# EAGLE design bristol_longshot (EAGLE 7.3.0)
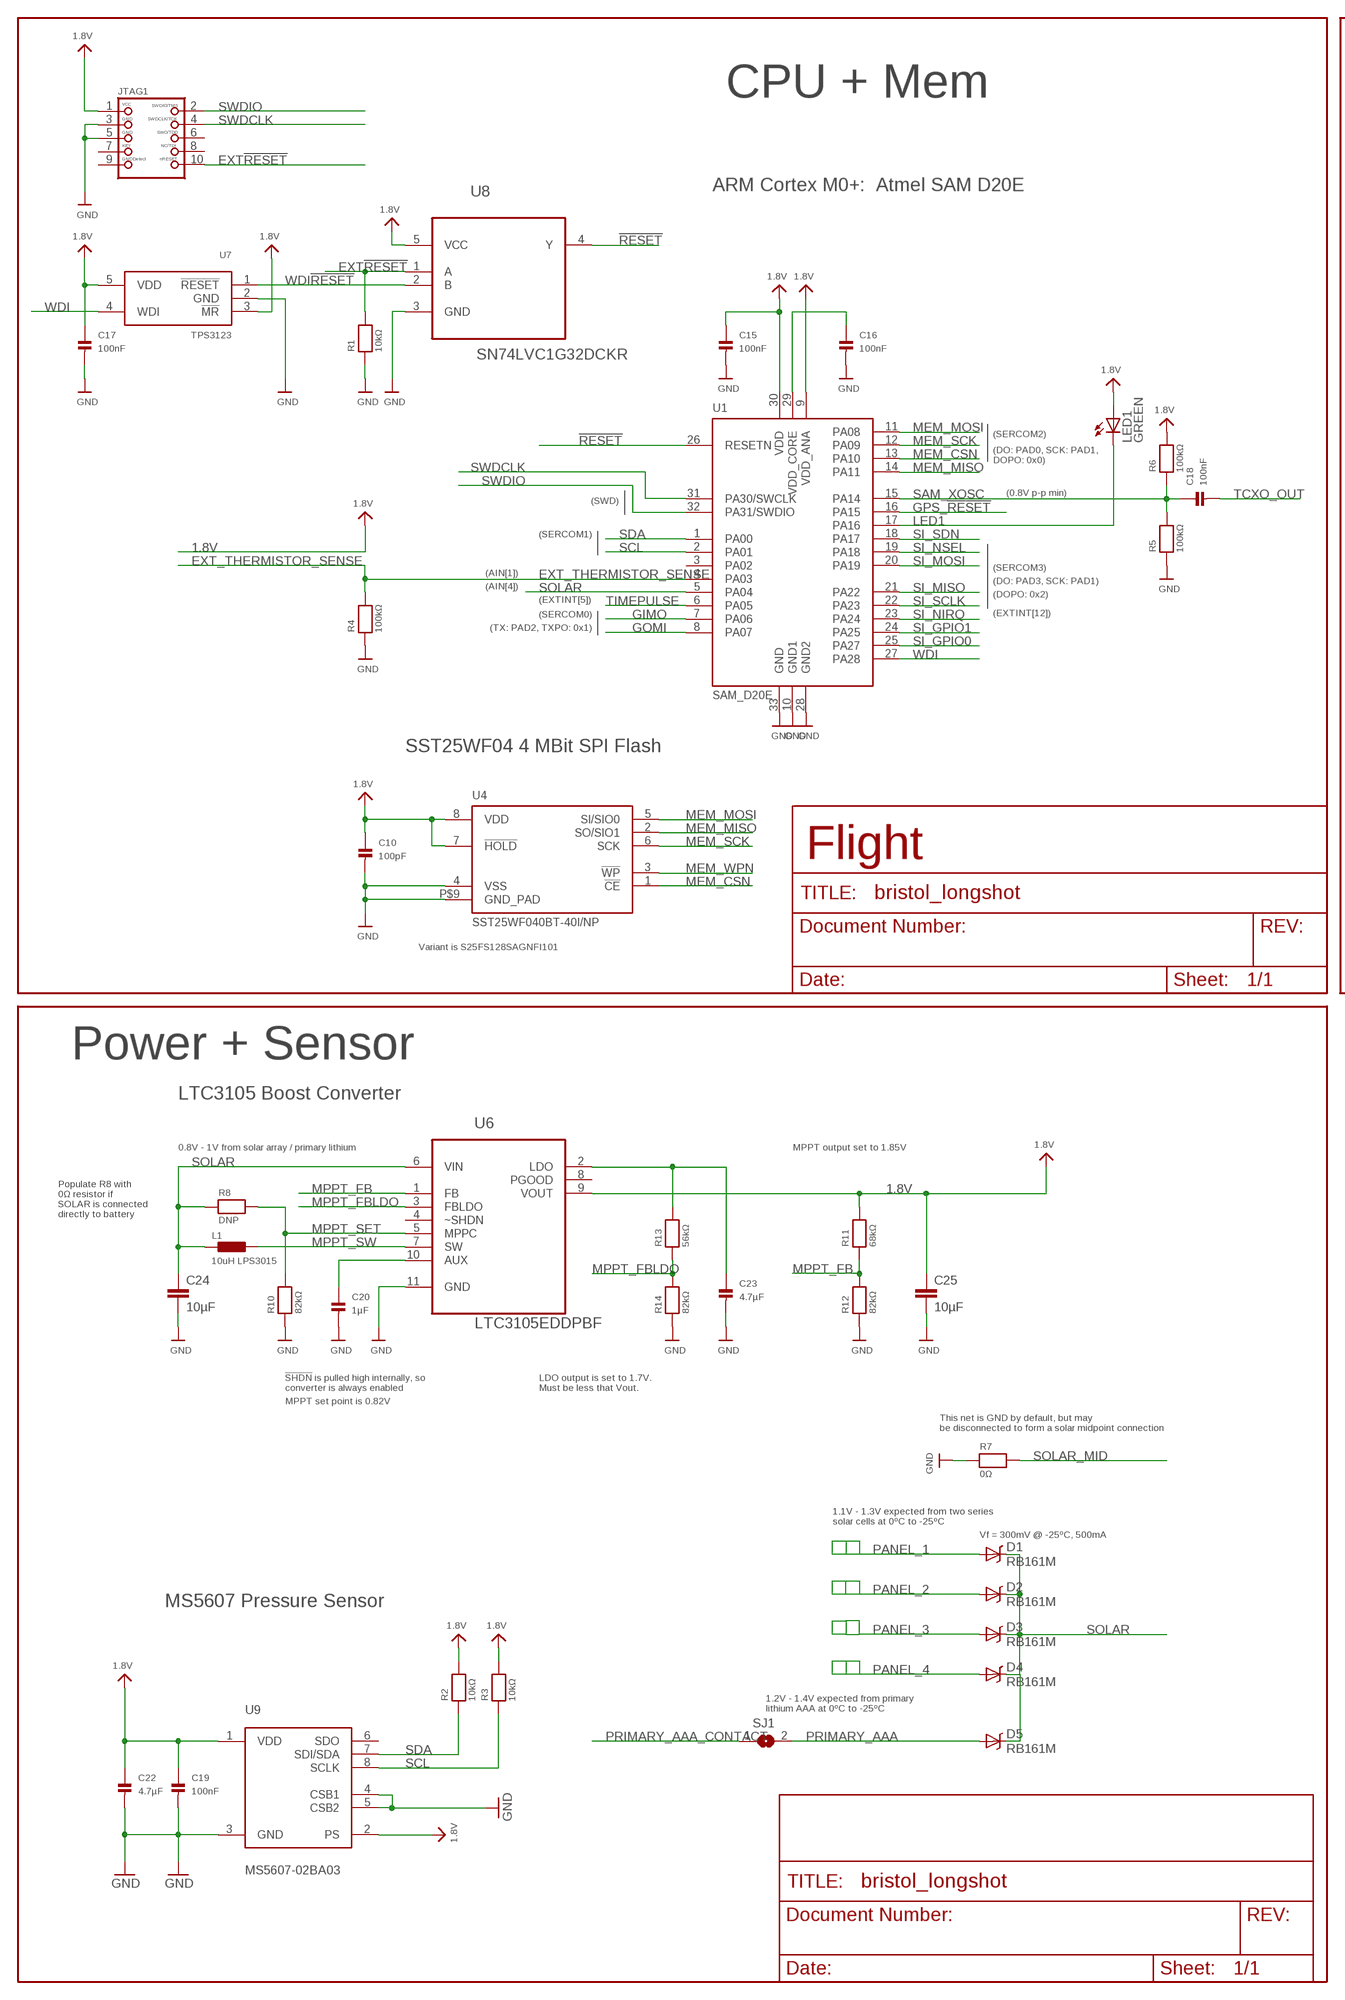
[diagram p0: schematic, sheet 1, part 1 of 2]
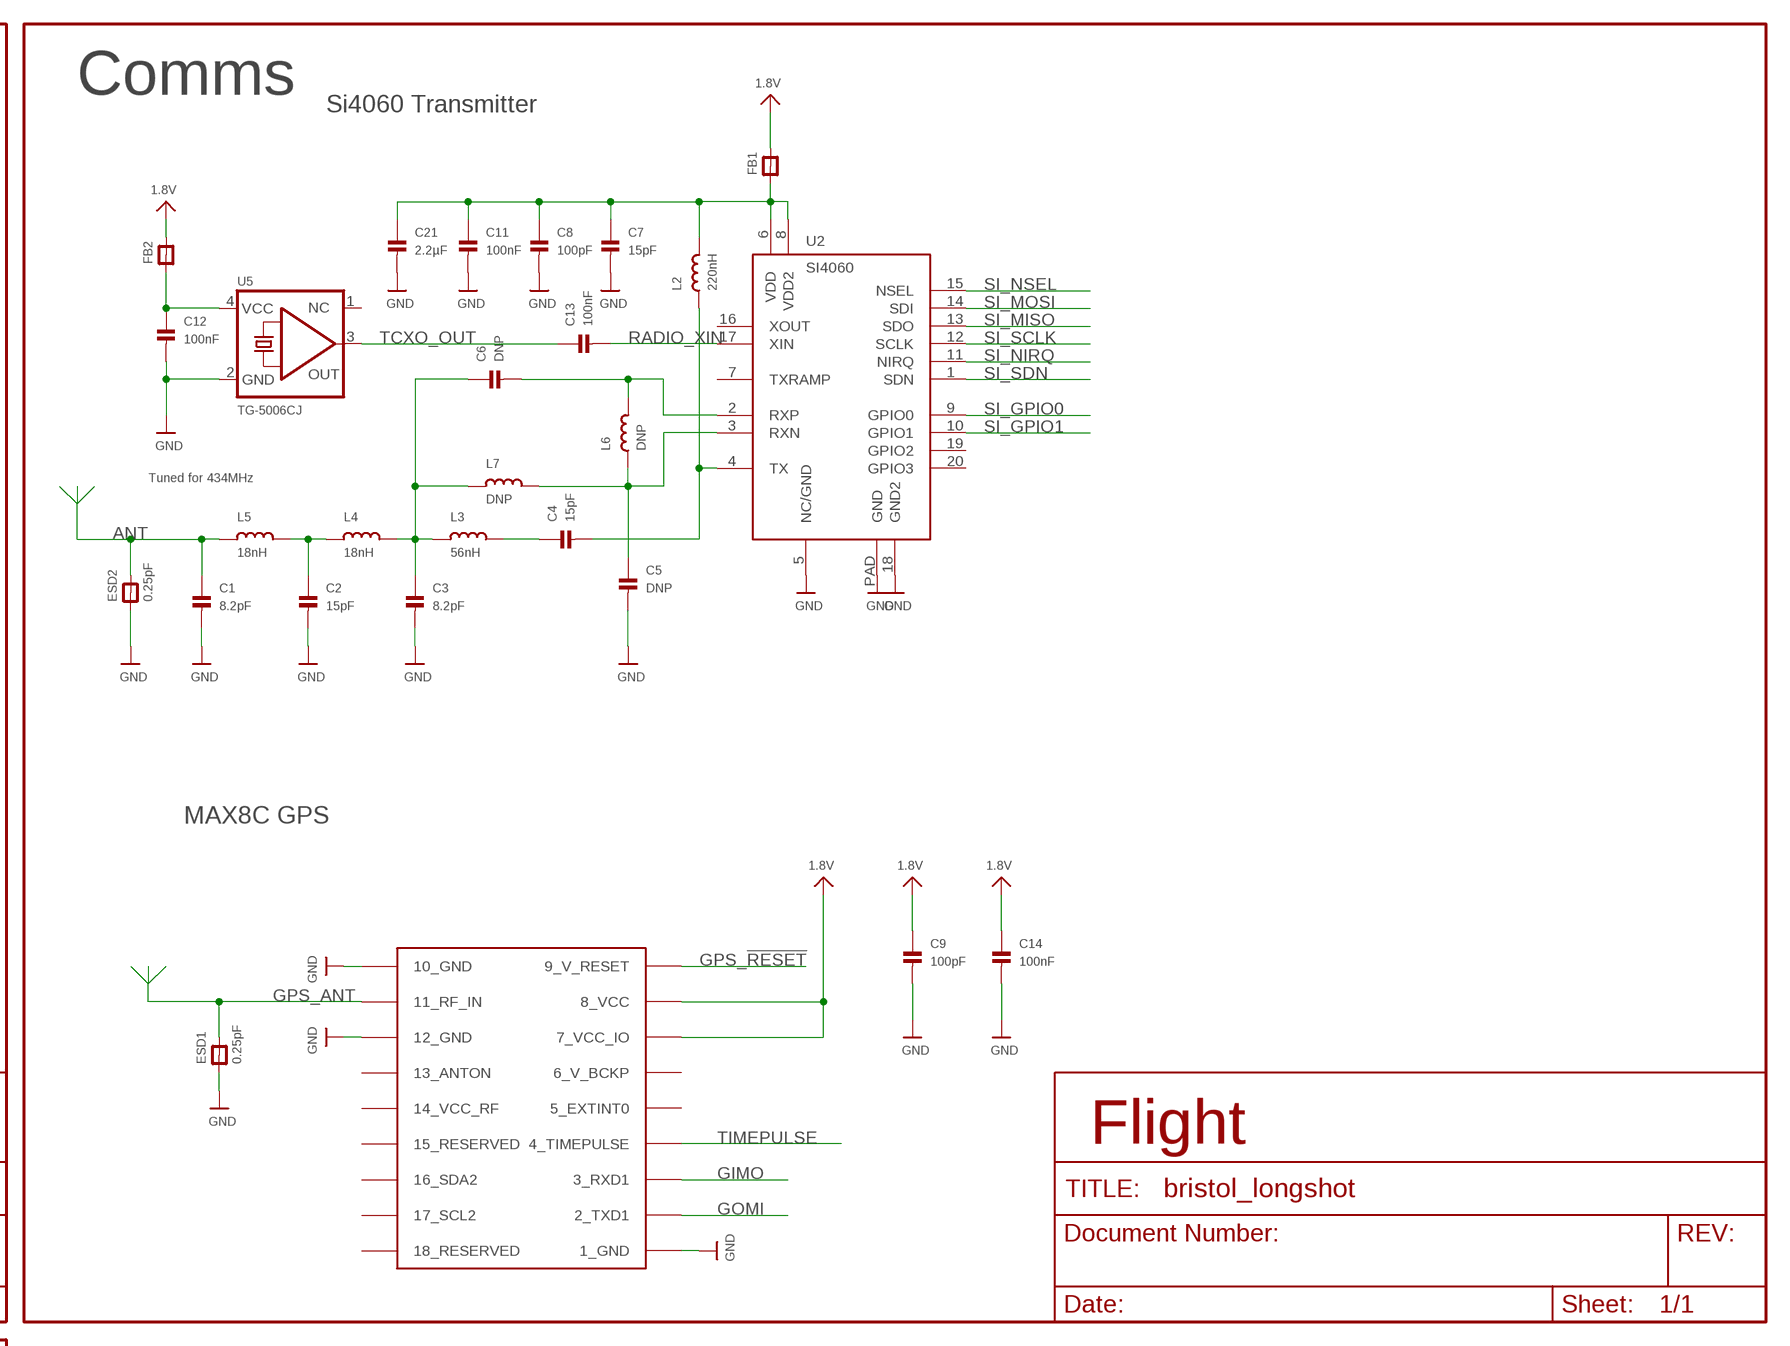
[diagram p1: schematic, sheet 1, part 2 of 2]

## Parts
C1  8.2pF  CAP_CERAMIC_0402  [_0402@1]
C2  15pF  CAP_CERAMIC_0402  [_0402@1]
C3  8.2pF  CAP_CERAMIC_0402  [_0402@1]
C4  15pF  CAP_CERAMIC_0402  [_0402@1]
C5  DNP  CAP_CERAMIC_0402  [_0402@1]
C6  DNP  CAP_CERAMIC_0402  [_0402@1]
C7  15pF  CAP_CERAMIC_0402  [_0402@1]
C8  100pF  CAP_CERAMIC_0402  [_0402@1]
C9  100pF  CAP_CERAMIC_0402  [_0402@1]
C10  100pF  CAP_CERAMIC_0402  [_0402@1]
C11  100nF  CAP_CERAMIC_0402  [_0402@1]
C12  100nF  CAP_CERAMIC_0402  [_0402@1]
C13  100nF  CAP_CERAMIC_0402  [_0402@1]
C14  100nF  CAP_CERAMIC_0402  [_0402@1]
C15  100nF  CAP_CERAMIC_0402  [_0402@1]
C16  100nF  CAP_CERAMIC_0402  [_0402@1]
C17  100nF  CAP_CERAMIC_0402  [_0402@1]
C18  100nF  CAP_CERAMIC_0402  [_0402@1]
C19  100nF  CAP_CERAMIC_0402  [_0402@1]
C20  1µF  CAP_CERAMIC_0402  [_0402@1]
C21  2.2µF  CAP_CERAMIC_0402  [_0402@1]
C22  4.7µF  CAP_CERAMIC_0402  [_0402@1]
C23  4.7µF  CAP_CERAMIC_0402  [_0402@1]
C24  10µF  C-EUC0603K  [C0603K]
C25  10µF  C-EUC0603K  [C0603K]
D1  RB161M  [RB161M]
D2  RB161M  [RB161M]
D3  RB161M  [RB161M]
D4  RB161M  [RB161M]
D5  RB161M  [RB161M]
ESD1  0.25pF  FERRITE_0603MP  [_0603MP]
ESD2  0.25pF  FERRITE_0603MP  [_0603MP]
FB1  FERRITE_0402  [_0402@1]
FB2  FERRITE_0402  [_0402@1]
JTAG1  JTAG-CORTEXM3SMT  [2X05_1.27MM_SMT]
L1  10uH LPS3015  IND-LPS3015  [LPS3015]
L2  220nH  INDUCTOR_0402  [_0402@1]
L3  56nH  INDUCTOR_0402  [_0402@1]
L4  18nH  INDUCTOR_0402  [_0402@1]
L5  18nH  INDUCTOR_0402  [_0402@1]
L6  DNP  INDUCTOR_0402  [_0402@1]
L7  DNP  INDUCTOR_0402  [_0402@1]
LED1  GREEN  LEDCHIPLED_0603  [CHIPLED_0603]
R1  10kΩ  RESISTOR_0402  [_0402]
R2  10kΩ  RESISTOR_0402  [_0402]
R3  10kΩ  RESISTOR_0402  [_0402]
R4  100kΩ  RESISTOR_0402  [_0402]
R5  100kΩ  RESISTOR_0402  [_0402]
R6  100kΩ  RESISTOR_0402  [_0402]
R7  0Ω  RESISTOR_0402  [_0402]
R8  DNP  RESISTOR_0402  [_0402]
R10  82kΩ  RESISTOR_0402  [_0402]
R11  68kΩ  RESISTOR_0402  [_0402]
R12  82kΩ  RESISTOR_0402  [_0402]
R13  56kΩ  RESISTOR_0402  [_0402]
R14  82kΩ  RESISTOR_0402  [_0402]
SJ1  SOLDERJUMPERREFLOW  [SOLDERJUMPER_REFLOW]
U1  SAM_D20E  [QFN32_5MM]
U2  SI4060  [QFN20]
U3  UBLOX_MAX  [UBLOX_MAX]
U4  SST25WF040BT-40I/NP  [USON-8]
U5  TG-5006CJ  [TC-5006CJ]
U6  LTC3105EDDPBF  [DFN300X300X80-11N]
U7  TPS3123  [SOT23-5]
U8  SN74LVC1G32DCKR  [SOT65P210X110-5N]
U9  MS5607-02BA03  [MS5607-02BA03]

## Nets
1.8V: C9.1 C10.1 C14.1 C15.1 C17.1 C19.1 C22.1 C25.1 FB1.2 FB2.2 JTAG1.1 LED1.A R2.2 R3.2 R6.2 R11.2 U1.9(VDD_ANA) U1.30(VDD) U3.7_VCC_IO U3.8_VCC U4.7(!HOLD) U4.8(VDD) U6.9(VOUT) U7.3(!MR) U7.5(VDD) U8.5(VCC) U9.1(VDD) U9.2(PS)
!RESET: U1.26(RESETN) U8.4(Y)
ANT: C1.1 ESD2.2 L5.1
EXT!RESET: JTAG1.10 R1.2 U8.1(A)
EXT_THERMISTOR_SENSE: R4.2 U1.4(PA03)
FILTER1: C3.1 C6.1 L3.1 L4.2 L7.1
FILTER2: C2.1 L4.1 L5.2
GIMO: U1.7(PA06) U3.3_RXD1
GND: C1.2 C2.2 C3.2 C5.2 C7.2 C8.2 C9.2 C10.2 C11.2 C12.2 C14.2 C15.2 C16.2 C17.2 C19.2 C20.2 C21.2 C22.2 C23.2 C24.2 C25.2 ESD1.1 ESD2.1 JTAG1.3 JTAG1.5 R1.1 R4.1 R5.1 R7.1 R10.1 R12.1 R14.1 U1.10(GND1) U1.28(GND2) U1.33(GND) U2.5(NC/GND) U2.18(GND2) U2.PAD(GND) U3.1_GND U3.10_GND U3.12_GND U4.4(VSS) U4.P$9(GND_PAD) U5.2(GND) U6.11(GND) U7.2(GND) U8.3(GND) U9.3(GND) U9.4(CSB1) U9.5(CSB2)
GOMI: U1.8(PA07) U3.2_TXD1
GPS_!RESET: U1.16(PA15) U3.9_V_RESET
GPS_ANT: ESD1.2 U3.11_RF_IN
LED1: LED1.C U1.17(PA16)
MEM_CSN: U1.13(PA10) U4.1(!CE)
MEM_MISO: U1.14(PA11) U4.2(SO/SIO1)
MEM_MOSI: U1.11(PA08) U4.5(SI/SIO0)
MEM_SCK: U1.12(PA09) U4.6(SCK)
MEM_WPN: U4.3(!WP)
MPPT_AUX: C20.1 U6.10(AUX)
MPPT_FB: R11.1 R12.2 U6.1(FB)
MPPT_FBLDO: R13.1 R14.2 U6.3(FBLDO)
MPPT_LDO: C23.1 R13.2 U6.2(LDO)
MPPT_SET: R8.2 R10.2 U6.5(MPPC)
MPPT_SW: L1.2_1 L1.2_2 L1.2_3 L1.2_4 L1.2_5 L1.2_6 L1.2_7 L1.2_8 L1.2_9 U6.7(SW)
PANEL_1: D1.ANODE(A)
PANEL_2: D2.ANODE(A)
PANEL_3: D3.ANODE(A)
PANEL_4: D4.ANODE(A)
PRIMARY_AAA: D5.ANODE(A) SJ1.2
PRIMARY_AAA_CONTACT: SJ1.1
RADIO_VDD: C7.1 C8.1 C11.1 C21.1 FB1.1 L2.2 U2.6(VDD) U2.8(VDD2)
RADIO_XIN: C13.2 U2.17(XIN)
RF_OUT: C4.2 L2.1 U2.4(TX)
RF_TANK: C4.1 L3.2
RXN: C5.1 L6.1 L7.2 U2.3(RXN)
RXP: C6.2 L6.2 U2.2(RXP)
SAM_XOSC: C18.1 R5.2 R6.1 U1.15(PA14)
SCL: R3.1 U1.2(PA01) U9.8(SCLK)
SDA: R2.1 U1.1(PA00) U9.7(SDI/SDA)
SI_GPIO0: U1.25(PA27) U2.9(GPIO0)
SI_GPIO1: U1.24(PA25) U2.10(GPIO1)
SI_MISO: U1.21(PA22) U2.13(SDO)
SI_MOSI: U1.20(PA19) U2.14(SDI)
SI_NIRQ: U1.23(PA24) U2.11(NIRQ)
SI_NSEL: U1.19(PA18) U2.15(NSEL)
SI_SCLK: U1.22(PA23) U2.12(SCLK)
SI_SDN: U1.18(PA17) U2.1(SDN)
SOLAR: C24.1 D1.CATHODE(C) D2.CATHODE(C) D3.CATHODE(C) D4.CATHODE(C) D5.CATHODE(C) L1.1_1 L1.1_2 L1.1_3 L1.1_4 L1.1_5 L1.1_6 L1.1_7 L1.1_8 L1.1_9 R8.1 U1.5(PA04) U6.6(VIN)
SOLAR_MID: R7.2
SWDCLK: JTAG1.4 U1.31(PA30/SWCLK)
SWDIO: JTAG1.2 U1.32(PA31/SWDIO)
TCXO_OUT: C13.1 C18.2 U5.3(OUT)
TCXO_VDD: C12.1 FB2.1 U5.4(VCC)
TIMEPULSE: U1.6(PA05) U3.4_TIMEPULSE
VDD_CORE: C16.1 U1.29(VDD_CORE)
WDI: U1.27(PA28) U7.4(WDI)
WDI!RESET: U7.1(!RESET) U8.2(B)
Unconnected: JTAG1.6 JTAG1.7 JTAG1.8 JTAG1.9 U1.3(PA02) U2.7(TXRAMP) U2.16(XOUT) U2.19(GPIO2) U2.20(GPIO3) U3.5_EXTINT0 U3.6_V_BCKP U3.13_ANTON U3.14_VCC_RF U3.15_RESERVED U3.16_SDA2 U3.17_SCL2 U3.18_RESERVED U5.1(NC) U6.4(~SHDN) U6.8(PGOOD) U9.6(SDO)

## Notes on the sheet
- Comms
- Si4060 Transmitter
- CPU + Mem
- ARM Cortex M0+:  Atmel SAM D20E
- Tuned for 434MHz
- (SERCOM2)
- (DO: PAD0, SCK: PAD1,
  DOPO: 0x0)
- (0.8V p-p min)
- (SWD)
- (SERCOM1)
- (SERCOM3)
- (AIN[1])
- (DO: PAD3, SCK: PAD1)
- (AIN[4])
- (DOPO: 0x2)
- (EXTINT[5])
- (SERCOM0) | (EXTINT[12]) | MAX8C GPS
- (TX: PAD2, TXPO: 0x1)
- SST25WF04 4 MBit SPI Flash
- Flight | Flight
- Variant is S25FS128SAGNFI101
- Power + Sensor
- LTC3105 Boost Converter
- 0.8V - 1V from solar array / primary lithium | MPPT output set to 1.85V
- Populate R8 with
  0Ω resistor if
  SOLAR is connected
  directly to battery
- !SHDN! is pulled high internally, so
  converter is always enabled
- LDO output is set to 1.7V.
  Must be less that Vout.
- MPPT set point is 0.82V
- This net is GND by default, but may
  be disconnected to form a solar midpoint connection
- 1.1V - 1.3V expected from two series
  solar cells at 0ºC to -25ºC
- Vf = 300mV @ -25ºC, 500mA
- MS5607 Pressure Sensor
- 1.2V - 1.4V expected from primary
  lithium AAA at 0ºC to -25ºC

## Library data of the parts
C1-C23 = microbuilder_v3:CAP_CERAMIC: Ceramic Capacitors 0402 - 0402 Surface Mount Capacitors 16pF 50V 5% [Digikey: 445-4899-2-ND] 18pF 50V 5% [Digikey: 490-1281-2-ND] 22pF 50V 5% [Digikey: 490-1283-2-ND] 68pF 50V 5% [Digikey: 490-1289-2-ND] 0.1uF 10V 10% [Digikey: 490-1318-2-ND] 1.0uF 6.3V 10% [Digikey: 490-1320-2-ND] 0603 - 0603 Surface Mount Capacitors 16 pF 50V 5% [Digikey: 445-5051-2-ND] 22 pF 50V [Digikey: PCC220ACVTR-ND] 33 pF 50V 5% [Digikey: 490-1415-1-ND] 56pF 50V 5% [Digikey: 490-1421-1-ND] 220pF 50V 5% [Digikey: 445-1285-1-ND] 680 pF 50V 2200 pF 50V 5% C0G [Digikey: 445-1297-1-ND] 5600 pF 100V 5% X7R [Digikey: 478-3711-1-ND] 0.1 µF 25V 10% [Digikey: PCC2277TR-ND] 0.22 µF 16V 10% X7R [Digikey: 445-1318-1-ND] 1.0 µF 25V 10% [Digikey: 445-5146-2-ND] 0603 - RF Specific 3pF 250V +/-0.1pF RF [Digikey: 712-1347-1-ND] 18 pF 250V 5% [Digikey: 478-3505-1-ND or 712-1322-1-ND] 56 pF 250V 5% C0G RF [Digikey: 490-4867-1-ND] 68 pF 250V RF [Digikey: 490-4868-1-ND] 0805 - 0805 Surface Mount Capacitors 220 pF 250V 2% RF Ceramic Capacitor [Digikey: 712-1398-1-ND] 1000 pF 50V 2% NP0 Ceramic Capacitor [Digikey: 478-3760-1-ND] 0.1 µF 25V 10% Ceramic Capacitor [Digikey: PCC1828TR-ND] 1.0 µF 16V 10% Ceramic Capacitor[Digikey: 490-1691-2-ND] 10.0 µF 10V 10% Ceramic Capacitor[Digikey: 709-1228-1-ND] 10.0 uF 16V 10% Ceramic Capacitor [Digikey: 478-5165-2-ND] 47 uF 6.3V 20% Ceramic Capacitor [Digikey: 587-1779-1-ND or 399-5506-1-ND] 1206 - 1206 Surface Mount Capacitors 47uF 10V 20% Ceramic Capacitor [Digikey: 490-5528-1-ND or 399-5508-1-ND or 445-6010-1-ND] 100uF 6.3V -20%, +80% Y5V Ceramic Capacitor (Digikey: 490-4512-1-ND, Mouser: 81-GRM31CF50J107ZE1L)
C24 C25 = resistor:C-EU: CAPACITOR, European symbol
D1-D5 = RB161M:RB161M
ESD1 ESD2 FB1 FB2 = microbuilder_v3:FERRITE: Ferrite Bead 0603 MMZ1608B121C - 120 Ohm @ 100MHz, 600mA, 0.15 Ohm DC Resistance - Digikey: 445-2164-1-ND BK1608HW121-T - 120 Ohm, 600mA Ferrite Chip - Digikey: 587-1876-2-ND 0805 HZ0805B272R-10 - 2.7K Ohm @ 100MHz, 200mA, 0.8 Ohm DC Resistance - Digikey: 240-2504-1-ND (see also Murata BLM21BD272SN1L) MMZ2012Y152B - 1.5K Ohm @ 100MHz, 500mA, 0.4 Ohm DC Resistance - Digikey: 445-1560-1-ND - Mainly for high frequency (80-400MHz) MMZ2012R102A - 1K Ohm @ 100MHz, 500mA, 0.3 Ohm DC Resistance - Digikey: 445-1555-2-ND - More general purpose (10-200MHz)
JTAG1 = microbuilder_v3:JTAG-CORTEXM3: Serial Wire (SW-DP) Connector This standard 0.05" 10-pin connector is for use with the Cortex M0/M3's native SWD (serial wire debugger) interface (SW-DP). Some boards support a 20-pin combined JTAG+SWD connector (SWJ-DP), such as the LPC1700 family, but many smaller devices only work with SWD which typically use the smaller 10-pin SW-DP connecter (the LPC1300 family, for example, only supports SWD). 2x05 1.27mm/0.05" Connector: This is the standard SMT connector defined by ARM for all Cortex devices, and should be used in most situations and for forward-compatibility since any new devices coming to market will likely use this connector. MOLEX 10 Pin 0.1" Connector: This 0.1" 10 pin connector has the same pin layout as the standard 0.05" connector, but is easier to work with if you are using standard jumper wires or custom cables to connect your SWD hardware. MOLEX 20 Pin 0.1" Connector: This 0.1" 20 pin connector is the same model used for ARM7/ARM9 JTAG debuggers, but is connected to match the pins on the Segger J-Link for ARM (which supports both JTAG and SWD debugging). See the following document from ARM for more information on Cortex M3 Debug Connectors: http://infocenter.arm.com/help/topic/com.arm.doc.faqs/attached/13634/cortex_debug_connectors.pdf And the following page for an overview with images of the different connector types: http://www.keil.com/peripherals/coresight/connectors.asp
L1 = PecanFemto4:IND-LPS3015
L2-L7 = microbuilder_v3:INDUCTOR: Inductors 0603: 10nH Ceramic Inductor - microwire antenna/RF (Digikey: 712-1434-2-ND) 0805: 560nH Ceramic Inductor - RF (Digikey: 553-1047-1-ND) 270nH Ceramic Inductor - Q = 40@250MHz, +-5%, 1 Ohm DC Resistance (Digikey: 535-10506-2-ND) 1007 (2518 Metric) SMT: 10µH 10% 250mOhm 820mA 1007 Inductor (Digikey: 587-2189-1-ND) 22µH 10% 500mOhm 580mA 1007 Inductor (Digikey: 587-2190-1-ND) 47µH 10% 950mOhm 420mA 1007 Inductor (Digikey: 587-2191-1-ND) 47µH 5% 100mOhm 1A 1008 Inductor (Digikey: 732-1816-1-ND) 5.0x5.0mm (Taiyo Yuden NR5040 Series) 6.8µH 20% 2.3A 64mOhm Inductor (Digikey: 587-2374-2-ND) 5.0x5.0mm (TDK VLC5045 Series) 4.7µH 20% 3.3A 34mOhm Inductor (Digikey: 445-6526-1-ND) 6.8µH 20% 2.7A 46mOhm Inductor (Digikey: 445-6527-1-ND) 6.0x6.0mm (TDK VLC6045 Series) 4.7µH 20% 3.8A 27mOhm Inductor (Digikey: 445-6538-2-ND) 6.8µH 20% 3A 41mOhm Inductor (Digikey: 445-6540-1-ND) 6.2µH 30% 2.2A 45mOhm Inductor (Digikey: SRR5028-6R2YCT-ND) - Not TDK VLC6045 but footprint should match 6.0x6.0mm (TDK SLF6045 Series) 6.8uH 30% 2A 33mOhm Inductor (Digikey: 445-4572-1-ND, Mouser: 810-SLF645T6R8N2R0PF)
LED1 = led:LED: LED OSRAM: - CHIPLED LG R971, LG N971, LY N971, LG Q971, LY Q971, LO R971, LY R971 LH N974, LH R974 LS Q976, LO Q976, LY Q976 LO Q996 - Hyper CHIPLED LW Q18S LB Q993, LB Q99A, LB R99A - SideLED LS A670, LO A670, LY A670, LG A670, LP A670 LB A673, LV A673, LT A673, LW A673 LH A674 LY A675 LS A676, LA A676, LO A676, LY A676, LW A676 LS A679, LY A679, LG A679 - Hyper Micro SIDELED® LS Y876, LA Y876, LO Y876, LY Y876 LT Y87S - SmartLED LW L88C, LW L88S LB L89C, LB L89S, LG L890 LS L89K, LO L89K, LY L89K LS L896, LA L896, LO L896, LY L896 - TOPLED LS T670, LO T670, LY T670, LG T670, LP T670 LSG T670, LSP T670, LSY T670, LOP T670, LYG T670 LG T671, LOG T671, LSG T671 LB T673, LV T673, LT T673, LW T673 LH T674 LS T676, LA T676, LO T676, LY T676, LB T676, LH T676, LSB T676, LW T676 LB T67C, LV T67C, LT T67C, LS T67K, LO T67K, LY T67K, LW E67C LS E67B, LA E67B, LO E67B, LY E67B, LB E67C, LV E67C, LT E67C LW T67C LS T679, LY T679, LG T679 LS T770, LO T770, LY T770, LG T770, LP T770 LB T773, LV T773, LT T773, LW T773 LH T774 LS E675, LA E675, LY E675, LS T675 LS T776, LA T776, LO T776, LY T776, LB T776 LHGB T686 LT T68C, LB T68C - Hyper Mini TOPLED® LB M676 - Mini TOPLED Santana® LG M470 LS M47K, LO M47K, LY M47K Source: http://www.osram.convergy.de LUXEON: - LUMILED® LXK2-PW12-R00, LXK2-PW12-S00, LXK2-PW14-U00, LXK2-PW14-V00 LXK2-PM12-R00, LXK2-PM12-S00, LXK2-PM14-U00 LXK2-PE12-Q00, LXK2-PE12-R00, LXK2-PE12-S00, LXK2-PE14-T00, LXK2-PE14-U00 LXK2-PB12-K00, LXK2-PB12-L00, LXK2-PB12-M00, LXK2-PB14-N00, LXK2-PB14-P00, LXK2-PB14-Q00 LXK2-PR12-L00, LXK2-PR12-M00, LXK2-PR14-Q00, LXK2-PR14-R00 LXK2-PD12-Q00, LXK2-PD12-R00, LXK2-PD12-S00 LXK2-PH12-R00, LXK2-PH12-S00 LXK2-PL12-P00, LXK2-PL12-Q00, LXK2-PL12-R00 Source: www.luxeon.com KINGBRIGHT: KA-3528ASYC Source: www.kingbright.com
R1-R8 R10-R14 = microbuilder_v3:RESISTOR: Resistors 0402 - 0402 Surface Mount Package 22 Ohm 1% 1/16W [Digikey: 311-22.0LRTR-ND] 33 Ohm 5% 1/16W 1.0K 5% 1/16W 1.5K 5% 1/16W 2.0K 1% 1/16W 10.0K 1% 1/16W [Digikey: 311-10.0KLRTR-ND] 10.0K 5% 1/16W [Digikey: RMCF0402JT10K0TR-ND] 12.1K 1% 1/16W [Digikey: 311-22.0LRTR-ND] 100.0K 5% 1/16W 0603 - 0603 Surface Mount Package 0 Ohm 1/10 Watt 1% Resistor 15 Ohm 1/10 Watt 1% Resistor 33 Ohm 1/10 Watt 1% Resistor 49.9 Ohm 1/10 Watt 1% Resistor 100 Ohm 1/10 Watt 1% Resistor 150 Ohm 1/10 Watt 1% Resistor 240 Ohm 1/10 Watt 1% Resistor 390 Ohm 1/10 Watt 1% Resistor 560 Ohm 1/10 Watt 1% Resistor 680 Ohm 1/10 Watt 1% Resistor 750 Ohm 1/10 Watt 1% Resistor 1.0K Ohm 1/10 Watt 1% Resistor 1.5K Ohm 1/10 Watt 1% Resistor 2.0K Ohm 1/10 Watt 1% Resistor 2.2K Ohm 1/10 Watt 1% Resistor 3.3K Ohm 1/10 Watt 1% Resistor 4.7K Ohm 1/10 Watt 1% Resistor 10.0K Ohm 1/10 Watt 1% Resistor 12.0K Ohm 1/10 Watt 1% Resistor 12.1K Ohm 1/10 Watt 1% Resistor 20.0K Ohm 1/10 Watt 1% Resistor 33.0K Ohm 1/10 Watt 1% Resistor 100.0K Ohm 1/10 Watt 1% Resistor 0805 - 0805 Surface Mount Package 0 Ohm 1/8 Watt 1% Resistor 33 Ohm 1/8 Watt 1% Resistor 100 Ohm 1/8 Watt 1% Resistor 150 Ohm 1/8 Watt 1% Resistor 200 Ohm 1/8 Watt 1% Resistor 240 Ohm 1/8 Watt 1% Resistor 330 Ohm 1/8 Watt 1% Resistor 390 Ohm 1/8 Watt 1% Resistor 470 Ohm 1/8 Watt 1% Resistor 1.0K Ohm 1/8 Watt 1% Resistor 1.5K Ohm 1/8 Watt 1% Resistor 2.0K Ohm 1/8 Watt 1% Resistor 4.7K Ohm 1/8 Watt 1% Resistor 5.1K Ohm 1/8 Watt 1% Resistor 5.6K Ohm 1/8 Watt 1% Resistor 10.0K Ohm 1/8 Watt 1% Resistor 22.0K Ohm 1/8 Watt 1% Resistor 33.0K Ohm 1/8 Watt 1% Resistor 100K Ohm 1/8 Watt 1% Resistor 1206 - 1206 Surface Mount Package 2012 - 2010 Surface Mount Package 0.11 Ohm 1/2 Watt 1% Resistor - Digikey: RHM.11UCT-ND
SJ1 = microbuilder_v3:SOLDERJUMPER: SMD Solder JUMPER Solder the two pads together to create a connection, or remove the solder to break it. REFLOW - Use this footprint for solder paste and reflow ovens. WAVE - Use this footprint for hand-soldering (larger pads). CLOSED - Has a trace between the two pads to ensure it is closed by default. The trace needs to be cut to disable the jumper, and can be closed again by creating a solder bridge between the two pads.
U1 = fbri:SAM_D20E
U2 = fbri:SI4060
U3 = Ava:UBLOX_MAX: UBLOX MAX
U4 = fbri:SST25WF040BT-40I/NP
U5 = fbri:TG-5006CJ
U6 = ltc3105:LTC3105EDDPBF: 400mA Step-Up DC/DC Converter with Maximum Power Point Control and 250mV Start-Up; MPN: LTC3105EDD#PBF; OC_FARNELL: 1898600; OC_NEWARK: 27T5809; PACKAGE: DFN-10; SUPPLIER: Linear Technology
U7 = TPS3125:TPS3123
U8 = SN74LVC1G32DCKR:SN74LVC1G32DCKR: 2-INPUT POSITIVE-OR GATE; MPN: SN74LVC1G32DCKR; OC_FARNELL: 1470880; OC_NEWARK: 76C4094; PACKAGE: SC-70-5; SUPPLIER: Texas Instruments
U9 = MS5607-02BA03:MS5607-02BA03

## Board
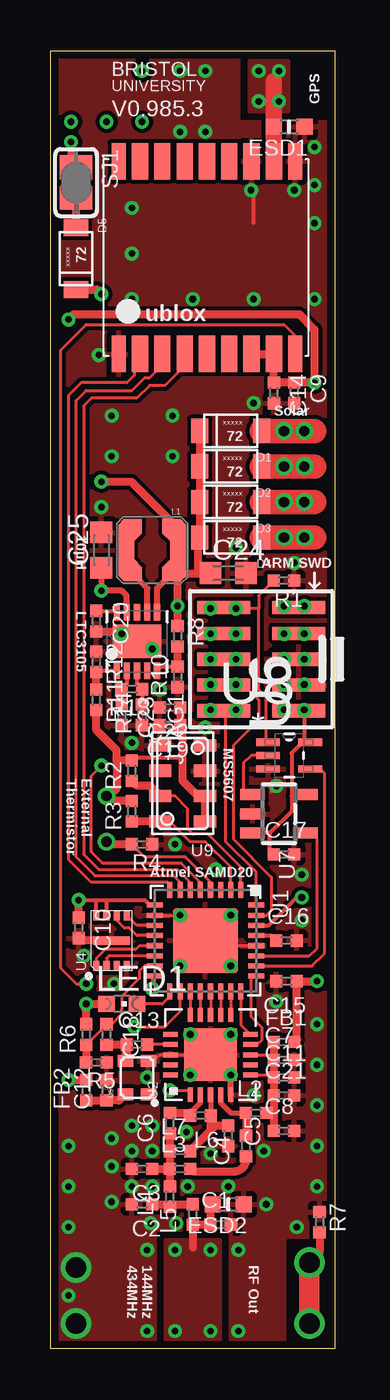
[diagram p2: board, top side]
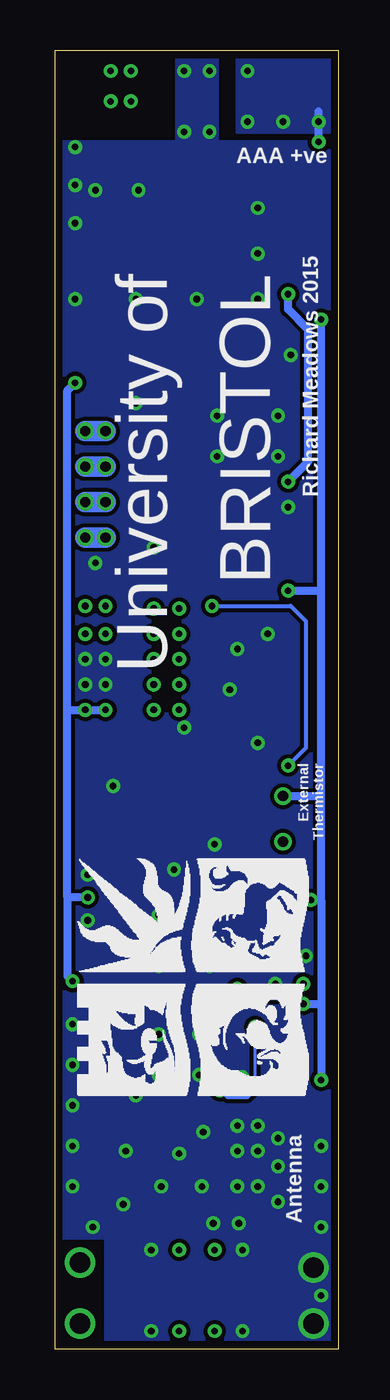
[diagram p3: board, bottom side, seen from below]

Size 14 x 64 mm. Coordinates in mm from the lower left corner, seen from the top.
Outline: 0,0 0,64 14,64 14,0 0,0
Copper layers (1*16): Top 0.0356mm / dielectric 1.5011mm / Bottom 0.0356mm
Design rules "oshpark": minimum track width 6mil, minimum drill 13mil, track to track 6mil, track to pad 6mil, pad to pad 6mil, via to via 6mil, smd to smd 6mil, copper to edge 15mil, drill to drill 6mil, minimum pad ring 7mil, minimum via ring 7mil, stop-mask expansion 3mil, vias tented up to drill 0mil, thermal gap 10mil

### Footprints (pad centres in the part's own frame; a part is rotated, then mirrored left to right if it is on the bottom)
_0402@1 = smd 0.6 x 0.6: 1 -0.508,0; 2 0.508,0
C0603K = smd 1.05 x 1.08: 1 -0.875,0; 2 0.875,0
RB161M = smd 1.2 x 0.85: ANODE 0,-1.525; CATHODE 0,1.525
_0603MP = smd 0.8 x 0.8: 1 -0.762,0; 2 0.762,0
2X05_1.27MM_SMT = smd 0.65 x 2.6: 1 -2.54,-1.85; 2 -2.54,1.85; 3 -1.27,-1.85; 4 -1.27,1.85; 5 0,-1.85; 6 0,1.85; 7 1.27,-1.85; 8 1.27,1.85; 9 2.54,-1.85; 10 2.54,1.85
LPS3015 = smd 0.762 x 2.54: 1_1 -1.27,0; 2_1 1.27,0 | smd 0.889 x 0.254: 1_2 -0.953,-1.397; 1_3 -0.953,1.397; 2_2 0.953,-1.397; 2_3 0.953,1.397 | smd 0.381 x 0.445: 1_4 -0.699,-1.048; 1_5 -0.699,1.048; 2_4 0.699,-1.048; 2_5 0.699,1.048 | smd 0.359 x 0.359 rotated 45: 1_6 -1.398,-1.271; 1_7 -1.398,1.271 | smd 0.538 x 0.538 rotated 45: 1_8 -0.889,-0.823; 1_9 -0.889,0.823 | smd 0.359 x 0.359 rotated 225: 2_6 1.398,-1.271; 2_7 1.398,1.271 | smd 0.538 x 0.538 rotated 225: 2_8 0.889,-0.823; 2_9 0.889,0.823
CHIPLED_0603 = smd 0.8 x 0.8: A 0,-0.75; C 0,0.75
_0402 = smd 0.6 x 0.6: 1 -0.508,0; 2 0.508,0
SOLDERJUMPER_REFLOW = smd 1.168 x 1.6: 1 -0.762,0; 2 0.762,0
QFN32_5MM = smd 0.8 x 0.25: 1 -2.5,1.75; 2 -2.5,1.25; 3 -2.5,0.75; 4 -2.5,0.25; 5 -2.5,-0.25; 6 -2.5,-0.75; 7 -2.5,-1.25; 8 -2.5,-1.75; 17 2.5,-1.75; 18 2.5,-1.25; 19 2.5,-0.75; 20 2.5,-0.25; 21 2.5,0.25; 22 2.5,0.75; 23 2.5,1.25; 24 2.5,1.75 | smd 0.25 x 0.8: 9 -1.75,-2.5; 10 -1.25,-2.5; 11 -0.75,-2.5; 12 -0.25,-2.5; 13 0.25,-2.5; 14 0.75,-2.5; 15 1.25,-2.5; 16 1.75,-2.5; 25 1.75,2.5; 26 1.25,2.5; 27 0.75,2.5; 28 0.25,2.5; 29 -0.25,2.5; 30 -0.75,2.5; 31 -1.25,2.5; 32 -1.75,2.5 | smd 3.2 x 3.2: 33 0,0
QFN20 = smd 0.7 x 0.25: 1 -1.97,1; 2 -1.97,0.5; 3 -1.97,0; 4 -1.97,-0.5; 5 -1.97,-1; 11 1.97,-1; 12 1.97,-0.5; 13 1.97,0; 14 1.97,0.5; 15 1.97,1 | smd 0.25 x 0.7: 6 -1,-1.97; 7 -0.5,-1.97; 8 0,-1.97; 9 0.5,-1.97; 10 1,-1.97; 16 1,1.97; 17 0.5,1.97; 18 0,1.97; 19 -0.5,1.97; 20 -1,1.97 | smd 2.6 x 2.6: PAD 0,0
UBLOX_MAX = smd 1.8 x 0.7: 1_GND 4.95,-4.4; 9_V_RESET 4.95,4.3; 10_GND -4.55,4.3; 18_RESERVED -4.55,-4.4 | smd 1.8 x 0.8: 2_TXD1 4.95,-3.35; 3_RXD1 4.95,-2.25; 4_TIMEPULSE 4.95,-1.15; 5_EXTINT0 4.95,-0.05; 6_V_BCKP 4.95,1.05; 7_VCC_IO 4.95,2.15; 8_VCC 4.95,3.25; 11_RF_IN -4.55,3.25; 12_GND -4.55,2.15; 13_ANTON -4.55,1.05; 14_VCC_RF -4.55,-0.05; 15_RESERVED -4.55,-1.15; 16_SDA2 -4.55,-2.25; 17_SCL2 -4.55,-3.35
USON-8 = smd 0.3 x 0.5: 1 -0.75,-1.25; 2 -0.25,-1.25; 3 0.25,-1.25; 4 0.75,-1.25; 5 0.75,1.25; 6 0.25,1.25; 7 -0.25,1.25; 8 -0.75,1.25 | smd 1.8 x 0.4: P$9 0,0
TC-5006CJ = smd 0.6 x 0.75: 1 -0.825,-0.565; 2 0.825,-0.565; 3 0.825,0.565; 4 -0.825,0.565
DFN300X300X80-11N = smd 0.813 x 0.305: 1 -1.448,0.991; 2 -1.448,0.508; 3 -1.448,0; 4 -1.448,-0.508; 5 -1.448,-0.991; 6 1.448,-0.991; 7 1.448,-0.508; 8 1.448,0; 9 1.448,0.508; 10 1.448,0.991 | smd 1.651 x 2.388: 11 0,0
SOT23-5 = smd 0.55 x 1.2: 1 -0.95,-1.3; 2 0,-1.3; 3 0.95,-1.3; 4 0.95,1.3; 5 -0.95,1.3
SOT65P210X110-5N = smd 1.168 x 0.356: 1 -1.041,0.66; 2 -1.041,0; 3 -1.041,-0.66; 4 1.041,-0.66; 5 1.041,0.66
MS5607-02BA03 = smd 1.1 x 0.6: 1 -1.1,1.875; 2 -1.1,0.625; 3 -1.1,-0.625; 4 -1.1,-1.875; 5 1.1,-1.875; 6 1.1,-0.625; 7 1.1,0.625; 8 1.1,1.875

### Placement (x,y rotation side)
C1  8.38,6.12 0 top
C2  4.5,7.12 180 top
C3  4.5,8.88 180 top
C4  9.62,10 90 top
C5  8.75,10.5 270 top
C6  5.88,11.12 90 top
C7  11.5,14.25 0 top
C8  11.5,10.75 0 top
C9  12,47.12 270 top
C10  1.38,20.75 270 top
C11  11.5,13.38 0 top
C12  2.75,12.75 90 top
C13  4.25,15 0 top
C14  11,47.12 270 top
C15  11.62,18.12 180 top
C16  11.62,20.12 0 top
C17  11.5,24.38 0 top
C18  2.75,15.5 270 top
C19  5.88,30.75 180 top
C20  2.25,35.88 270 top
C21  11.5,12.5 0 top
C22  5.88,31.62 180 top
C23  3.5,31.25 270 top
C24  8.75,38.25 0 top
C25  2.5,39.38 90 top
D1  8.88,45.25 90 top
D2  8.88,43.5 90 top
D3  8.88,41.75 90 top
D4  8.88,40 90 top
D5  1.25,53.75 180 top
ESD1  11.75,60.25 180 top
ESD2  8.75,7.12 180 top
FB1  11.5,15.12 0 top
FB2  1.75,12.75 90 top
JTAG1  10.38,34 90 top
L1  5,39.38 180 top
L2  10.12,11.62 0 top
L3  6.38,8.88 0 top
L4  5.88,7.5 90 top
L5  7,6.62 90 top
L6  7.38,11.5 180 top
L7  6.38,9.75 0 top
LED1  3.5,17 270 top
R1  11.5,37.88 180 top
R2  4,28.5 90 top
R3  4,26.5 90 top
R4  4.5,24.88 180 top
R5  2.25,14.12 180 top
R6  1.75,15.5 90 top
R7  13.25,6.25 270 top
R8  6.25,35.12 270 top
R10  6.25,33.12 90 top
R11  2.25,32 270 top
R12  2.25,33.88 270 top
R13  4,32.52 180 top
R14  4.5,31.25 90 top
SJ1  1.25,57.5 270 top
U1  7.62,20.12 270 top
U2  7.88,14.5 90 top
U3  7.75,54 270 top
U4  3,20.12 0 top
U5  4.25,13.38 90 top
U6  4.25,34.88 90 top
U7  11.25,26.38 270 top
U8  11.75,29.25 0 top
U9  6.5,27.88 180 top

### Tracks (layer width: path | path; a pad name or v marks a point on that pad's centre or on a via)
1.8V  (via drill 0.33, 0.5)
  Top 0.2: U1.30 10.75,20.88 12.12,22.25 v12.38,22.25 | v1.38,22.12 2.25,22.12 | 2.25,22.12 2.75,22.12 | 2.75,22.12 4.62,22.12 4.88,21.88 U1.9 | U4.8 2.25,22.12 | U4.7 2.75,22.12 | C17.1 10.8,24.57 10.8,25.43 | U7.5 12.5,27.38 | 10.8,25.43 U7.3 | 12.55,27.18 U7.5 | 12.5,29.91 12.38,29.88 | 11.88,27.25 11.88,29.37 12.42,29.91 U8.5 12.5,29.91 | 11.88,27.25 12.3,27.32 U7.5 | 11.88,27.25 11.88,26.5 10.8,25.43 | 12.5,29.91 v12.5,31.5 12.27,31.5 JTAG1.1 12.19,31.5 v11.5,31.5 | 6.5,29.12 4.25,29.12 R2.2
  Top 0.3: U6.9 3.74,37.13 3.5,37.38 v2.5,37.38 C25.1
  Top 0.4: U3.7_VCC_IO 9.88,49.02 9.88,48.5 10,48.38 | LED1.A v1.75,17 R6.2 | v0.88,13.25 FB2.2 | v13.12,18.12 C15.1 12.13,15.25 FB1.2 | C10.1 v1.38,22.12 | 10.88,48.38 10.88,48.5 | 10.88,48.5 10.88,48.92 U3.8_VCC | 10.88,48.5 11,48.5 C14.1 C9.1 13,47.63 v13,47.62 13,50.25 12.25,51 1.12,51 v0.88,50.75 | v2.75,27.25 3,27.5 | 3.25,29 3.25,29.5 2.25,30.5 R11.2 | R3.2 3.24,27.01 v2.75,27.25 | 3.25,29 3.25,27.62 3,27.38 v2.75,27.25 | R2.2 | R2.2 | R2.2 3.25,29 | C22.1 C19.1 6.5,30.63 6.5,29.12 6.5,28 7.25,27.25 U9.2 U9.1
  Top 0.406: U3.7_VCC_IO U3.8_VCC
  Bottom 0.4: v1.38,22.12 0.88,22.12 | v12.38,22.25 13.38,22.25 | 13.38,22.25 13.38,18.38 v13.12,18.12 | 13.38,22.25 13.38,31.5 | 13.38,31.5 v11.5,31.5 | 13.38,31.5 13.38,47.25 v13,47.62 | 0.88,22.12 0.88,27.25 | 0.88,27.25 0.88,37.38 | 0.88,37.38 v0.88,50.75 | 0.88,22.12 0.88,17 | 0.88,17 v0.88,13.25 | v1.75,17 0.88,17 | v2.75,27.25 0.88,27.25 | v2.5,37.38 0.88,37.38
!RESET
  Top 0.152: U1.26 12.88,18.88 13.5,19.5 13.5,28.38 13.29,28.59 U8.4
ANT  (via drill 0.33)
  Top 0.406: 7,5 L5.1 C1.1 7.87,7 ESD2.2
  other vias: 6.12,4.88 7.88,4.88 7.88,0.88 6.12,0.88
  pour Top: 5.62,0 8.38,0 8.38,5.38 5.62,5.38
EXT!RESET  (via drill 0.33)
  Top 0.152: U8.1 10.62,30 10.62,32.12 10.25,32.5 10.25,36.5 | 10.25,36.5 v9.12,36.5 8.56,36.5 JTAG1.10 | R1.2 10.25,37.13 10.25,36.5
  Top 0.2: v7.88,36.5 7.92,36.54 JTAG1.10
EXT_THERMISTOR_SENSE  (via drill 0.5)
  Top 0.152: U1.4 7.88,23 6.62,24.25 4.62,24.25 R4.2
  Top 0.4: R4.2 3.12,24.88 v2.75,25
FILTER1
  Top 0.406: C6.1 5.87,10.62 L7.1 L3.1 | L3.1 5.88,9 L4.2 | C3.1 L3.1
FILTER2
  Top 0.406: C2.1 5.02,7.13 5.88,7.13 | 5.88,7.13 L5.2 | L4.1 5.88,7.13
GIMO
  Top 0.152: U3.3_RXD1 5.5,48.5 4.88,47.88 4.62,47.88 4,47.25 1.75,47.25 1.25,46.75 1.25,24.25 2.19,23.31 6.06,23.31 6.38,23 U1.7
GND  (via drill 0.33, 1)
  Top 0.152: U1.10 v6.38,21.38 U1.33 7.62,21.38 v8.88,21.38 | 6.88,14.25 6.62,14.5 U2.18 5.38,14.5 5.12,14.25 4.87,14.25 U5.2 | U1.28 9,19.88 9,19 v8.88,18.88 | U2.PAD v8.88,15.5
  Top 0.2: 10,55.5 10,56.88 | v11.12,27.75 10.88,27.5
  Top 0.305: 6.88,14.25 v6.88,13.5 | U2.5 v8.88,13.5
  Top 0.4: 2.25,20.12 1.5,20.12 C10.2 | C20.2 3.38,35.37 v3.5,35.25
  other vias: 6.38,18.88 10,12.5 0.88,2.62 4.75,4.88 4.75,0.88 9.25,4.88 9.25,0.88 6.69,10.69 0.88,8 0.88,10 5,11 5,8 3,7.25 13.12,8 10.5,9.75 7.88,9.62 3,9 4,8 6.75,8 10.62,7.12 8.75,8 13.12,10 13.12,12 4,9.75 5,9.75 6.19,6.19 4.94,6.19 4.75,13.38 4,11 3,10.38 12,57.12 9.88,57.12 13,59.25 13,57.38 2.38,49 13,55.5 6.38,60 7.62,60 13.12,14 11.12,17.12 12.38,21.12 6.88,15.5 11.5,34 13,51.75 1.62,19.38 12.38,23.38 11.5,32.75 12.5,32.75 12.5,34 13.12,16 1.25,1.25 1.25,4 5,34.5 10,46.62 9.12,39.5 12,38.75 3.12,18 10,51.75 7,51.75 4,51.75 4,54 5.38,32.5 2.5,41.5 3,46 6,46 0.88,6 12.12,6 4,56.25 3,44 6,44 6.38,63 7.62,63 7.62,30.62 6.12,24.88 4,29.88 8.12,23.62
  pour Top (isolate 0.2): 0,64 9.25,64 9.25,60.5 14,60.5 14,5.5 11.5,5.5 11.5,0 8.88,0 8.88,5.88 5.12,5.88 5.12,0 0,0
  pour Bottom (isolate 0.2): 0,59.5 6,59.5 6,64 8,64 8,59.5 14,59.5 14,5.5 11.5,5.5 11.5,0 0,0
  pour Bottom (isolate 0.2): 0,59.5 6,59.5 6,64 8,64 8,59.5 14,59.5 14,5.5 11.5,5.5 11.5,0 0,0
  pour Bottom (isolate 0.2): 0,59.5 6,59.5 6,64 8,64 8,59.5 14,59.5 14,5.5 11.5,5.5 11.5,0 0,0
  pour Bottom (isolate 0.2): 0,59.5 6,59.5 6,64 8,64 8,59.5 14,59.5 14,5.5 11.5,5.5 11.5,0 0,0
GOMI
  Top 0.152: 4.4,48.48 4.12,48.2 4.12,48 3.75,47.62 1.5,47.62 0.88,47 0.88,24.12 2,23 5.75,23 5.88,22.88 U1.8
  Top 0.2: U3.2_TXD1 4.4,48.48
GPS_!RESET  (via drill 0.33)
  Top 0.152: U3.9_V_RESET 12,49.1 12,50 11.5,50.5 1.75,50.5 0.5,49.25 0.5,18.75 1.25,18 v1.75,18 | U1.16 5,18.25 v5,17.75
  Bottom 0.152: v1.75,18 2.5,17.25 4.5,17.25 v5,17.75
GPS_ANT  (via drill 0.33)
  Top 0.2: 10.78,58.33 U3.11_RF_IN
  Top 0.406: U3.11_RF_IN 11,60.24 ESD1.2
  Top 0.819: U3.11_RF_IN 11,62.5
  other vias: 10.25,63 11.25,63 11.25,61.5 10.25,61.5
  pour Top: 9.75,61 11.75,61 11.75,63.5 9.75,63.5
LED1
  Top 0.152: U1.17 5.88,17.38 5.5,17 4.62,17
  Top 0.2: 4.62,17 LED1.C
MEM_CSN
  Top 0.152: U1.13 4.38,19.88 4.19,19.69 2.69,19.69 2.25,19.25 U4.1
MEM_MISO
  Top 0.152: U1.14 2.88,19.38 2.75,19.25 U4.2
MEM_MOSI
  Top 0.152: U1.11 4.25,20.88 U4.5
MEM_SCK
  Top 0.152: U1.12 4.25,20.38 3.88,20.75 3.62,20.75 3.25,21.12 U4.6
MPPT_AUX
  Top 0.2: C20.1 3.2,36.38 U6.10
MPPT_FB
  Top 0.2: U6.1 2.31,33.43 R12.2
  Top 0.4: R11.1 R12.2
MPPT_FBLDO
  Top 0.2: U6.3 4.25,32.78 R13.1 R14.2
MPPT_LDO
  Top 0.2: U6.2 3.74,32.77 R13.2 C23.1
MPPT_SET
  Top 0.2: U6.5 5.45,33.63 R10.2
  Top 0.4: R10.2 R8.2
MPPT_SW
  Top 0.2: 4.4,37.98 L1.2_3 | L1.2_3 4.3,38.23 L1.2_5 4.11,38.52 L1.2_9 3.73,38.93 L1.2_1 3.73,39.82 L1.2_8 4.11,40.23 L1.2_4 4.3,40.52 L1.2_2 3.73,40.77 L1.2_6 | L1.2_3 3.92,38.1 L1.2_7
  Top 0.3: U6.7 4.76,37.49 4.11,38.14 L1.2_9
N$1  (via drill 0.33)
  other vias: 11.5,35.25
N$2  (via drill 0.33)
  other vias: 12.5,35.25
N$3  (via drill 0.33)
  other vias: 12.5,36.62
N$4  (via drill 0.33)
  other vias: 11.5,36.62
N$6  (via drill 0.33)
  other vias: 7.88,35.25
N$7  (via drill 0.33)
  other vias: 7.88,34
N$10  (via drill 0.33)
  other vias: 9.12,35.25
N$11  (via drill 0.33)
  other vias: 9.12,34
PANEL_1  (via drill 0.5)
  Top 1.2: D1.ANODE v11.5,45.25 v12.5,45.25 13,45.25
  Bottom 1: v11.5,45.25 v12.5,45.25
PANEL_2  (via drill 0.5)
  Top 1.2: D2.ANODE v11.5,43.5 v12.5,43.5 13,43.5
  Bottom 1: v11.5,43.5 v12.5,43.5
PANEL_3  (via drill 0.5)
  Top 1.2: D3.ANODE v11.5,41.75 v12.5,41.75 13,41.75
  Bottom 1: v11.5,41.75 v12.5,41.75
PANEL_4  (via drill 0.5)
  Top 1.2: 13,40 v12.5,40 v11.5,40 D4.ANODE
  Bottom 1: v11.5,40 v12.5,40
PRIMARY_AAA
  Top 0.4: D5.ANODE SJ1.2
PRIMARY_AAA_CONTACT  (via drill 0.33)
  Top 0.4: v1,59.5 1,58.51 SJ1.1
  Bottom 0.4: v1,59.5 1,61
  other vias: 2.75,60.5 4.5,63 4.5,60.5 1,60.5
  pour Bottom (isolate 0.2): 0,64 5,64 5,60 0,60
RADIO_VDD
  Top 0.152: U2.8 10.87,14.5 C7.1 10.87,13.38 10.88,13.38 10.88,13.49 10.99,13.5 U2.6
  Top 0.406: FB1.1 C7.1 10.99,13.5 C11.1 C21.1 10.99,11.62 | 10.99,11.62 C8.1 | L2.2 10.99,11.62
RADIO_XIN
  Top 0.152: U2.17 C13.2
RF_OUT
  Top 0.254: U2.4 8.38,12.12 8.88,11.62 L2.1 9.68,11.75
  Top 0.406: L2.1 9.62,11.69 C4.2
RF_TANK
  Top 0.4: L3.2 7,8.76 7,8.75 9.13,8.75 arc90 C4.1
RXN
  Top 0.254: U2.3 L6.1
  Top 0.406: L7.2 7.88,10.76 | 7.88,10.76 L6.1 | 7.88,10.76 8.13,11.01 C5.1
RXP
  Top 0.254: U2.2 7.38,12.13 6.88,11.63 | 6.88,11.63 L6.2 | 6.88,11.63 L6.2
  Top 0.406: C6.2 6.86,11.63 L6.2
SAM_XOSC
  Top 0.152: U1.15 4.62,18.88 4.38,18.62 4.38,18.25 3.5,17.38 3.5,16.75 3.49,16.5 3,16 C18.1 2.75,15.99 R6.1
  Top 0.4: R6.1 R5.2
SCL
  Top 0.152: U1.2 8.88,23.75 7.62,25 6.88,25 6,25.88 5.53,25.88 U9.8
  Top 0.4: U9.8 R3.1
SDA
  Top 0.152: U1.1 9.38,23.75 7.75,25.38 7,25.38 6.75,25.62 6.75,26.62 6.12,27.25 U9.7
  Top 0.4: U9.7 4.9,27.75 4.24,27.75 R2.1
SI_GPIO0
  Top 0.152: U2.9 10.19,15 10.42,15.24 10.42,15.83 9.88,16.38 9.88,18.38 U1.25 10.17,18.33
SI_GPIO1
  Top 0.152: 9.62,15.5 U2.10 9.38,15.97 U1.24
SI_MISO
  Top 0.152: U1.21 U2.13
SI_MOSI
  Top 0.152: U1.20 U2.14
SI_NIRQ
  Top 0.152: U1.23 U2.11
SI_NSEL
  Top 0.152: U1.19 U2.15
SI_SCLK
  Top 0.152: U1.22 U2.12
SI_SDN  (via drill 0.33)
  Top 0.152: 6.88,12.72 U2.1 6.88,12.75 v5.88,12.75 | v4.12,15.88 5.62,15.88 6.38,16.62 U1.18
  Bottom 0.152: v4.12,15.88 4.12,12.75 4.5,12.38 5.5,12.38 v5.88,12.75
SOLAR  (via drill 0.33)
  Top 0.152: U1.5 7.38,23 6.44,23.94 2.56,23.94 2,24.5 2,28.25 v2.5,28.75
  Top 0.2: L1.1_6 6.27,40.77 L1.1_2 5.7,40.52 L1.1_4 5.89,40.23 L1.1_8 6.27,39.82 L1.1_1 6.27,38.88 6.27,38.55 L1.1_9 5.7,38.55 L1.1_5 5.7,37.98 L1.1_3 | L1.1_7 6.4,37.98 L1.1_3 | U6.6 5.25,36.33 | 5.85,37.98 L1.1_3 | 6.38,38.08 L1.1_7 | 6.49,38.2 L1.1_7
  Top 0.3: 5.25,36.33 5.25,37.5 5.89,38.14 L1.1_9
  Top 0.4: C24.1 7.82,38.2 7.25,38.2 | D1.CATHODE D2.CATHODE D3.CATHODE D4.CATHODE 7.25,39.98 7.25,39.5 | 7.25,39.5 7.25,38.2 | 7.12,39.62 7.25,39.5 | 7.25,38.2 6.49,38.2 | 6.27,38.88 6.25,38.85 v6.25,36.62 R8.1 | v2.5,42.75 3.97,42.75 L1.1_2 | D5.CATHODE 2.27,52.23 v2.5,52
  Bottom 0.2: v6.25,36.62 2.38,36.62 1.62,35.88 1.62,29.62 v2.5,28.75
  Bottom 0.4: v2.5,42.75 1.5,43.75 1.5,50.25 2.5,51.25 v2.5,52
SOLAR_MID  (via drill 1)
  Top 0.4: R7.2 13.25,4.75 v12.75,4.25
  Top 1: v12.75,4.25 v12.75,1.25
SWDCLK  (via drill 0.33)
  Top 0.152: U1.31 10.62,21.38 10.88,21.62 10.88,23.25 9,25.12 9,29.75 10.25,31 10.25,32 9.52,32.73 9.25,32.73 JTAG1.4
  Top 0.2: v9.12,32.75 9.14,32.73 9.25,32.73 | v7.88,32.75 7.89,32.73 JTAG1.4
SWDIO  (via drill 0.33)
  Top 0.152: U1.32 10.12,23.5 8.62,25 8.62,31.31 JTAG1.2
  Top 0.2: v7.88,31.5 7.92,31.46 JTAG1.2 | 8.62,31.31 8.62,31.38 8.75,31.5 v9.12,31.5
TCXO_OUT
  Top 0.4: 3.69,14.75 U5.3 | C18.2 C13.1
  Top 0.406: C13.1 3.74,14.38 U5.3
TCXO_VDD
  Top 0.4: FB2.1 C12.1 3.38,12.24 U5.4
TIMEPULSE
  Top 0.152: 6.6,48.48 5.62,47.5 4.88,47.5 4.25,46.88 2,46.88 1.62,46.5 1.62,24.38 2.38,23.62 6.25,23.62 6.88,23 U1.6
  Top 0.2: U3.4_TIMEPULSE 6.6,48.48
VDD_CORE
  Top 0.2: U1.29 10.88,20.38 11.12,20.13 C16.1
WDI
  Top 0.152: U1.27 12.75,19.38 13.12,19.75 13.12,25.12 12.82,25.43 U7.4
WDI!RESET
  Top 0.152: U8.2 9.88,29.25 9.5,28.88 9.5,27.5 9.68,27.32 U7.1

### Text on the board
tPlace: BRISTOL | UNIVERSITY | V0.985.3 | GPS | Solar | 10µH | ARM SWD | LTC3105 | MS5607 | External / Thermistor | Atmel SAMD20 | 144MHz / 434MHz | RF Out
bPlace: AAA +ve | University of / BRISTOL | Richard Meadows 2015 | External / Thermistor | Antenna
tDocu: External / Thermistor